# Altium schematic sheet DCBlock.SchDoc
size A4
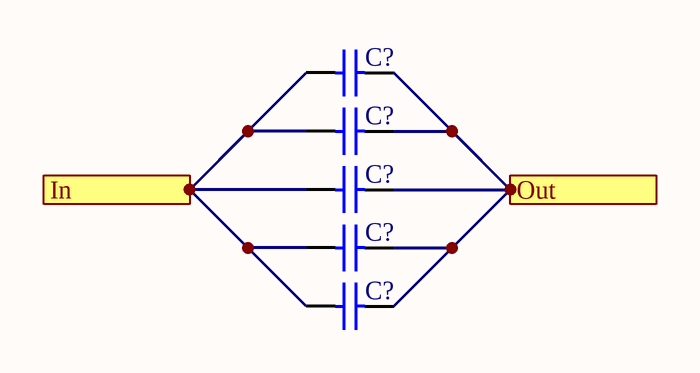
[diagram p0: DCBlock.SchDoc]

## Parts
(Parts that share a designator on the sheet are numbered #1, #2 ... from top to bottom, then left to right.)
C?#1  cap  [CAPC1210(3225)220_N]  (value not drawn)
C?#2  cap  [CAPC1210(3225)220_N]  (value not drawn)
C?#3  cap  [CAPC1210(3225)220_N]  (value not drawn)
C?#4  cap  [CAPC1210(3225)220_N]  (value not drawn)
C?#5  cap  [CAPC1210(3225)220_N]  (value not drawn)

## Ports
In, Out

## Nets
In: C?#1.1 C?#2.1 C?#3.1 C?#4.1 C?#5.1 ; port In
Out: C?#1.2 C?#2.2 C?#3.2 C?#4.2 C?#5.2 ; port Out

## Library data of the parts
C?#1-C?#5 = CMP-1038-02030-1: tbd; Value: 1uF; Case-EIA: 1210; Tolerance: Â±10%; Rated Voltage: 50 V; Case-Metric: 3225; Max Thickness: 2.2 mm; Technology: SMT